# EAGLE design AS6212_breakout (EAGLE 9.6.2)
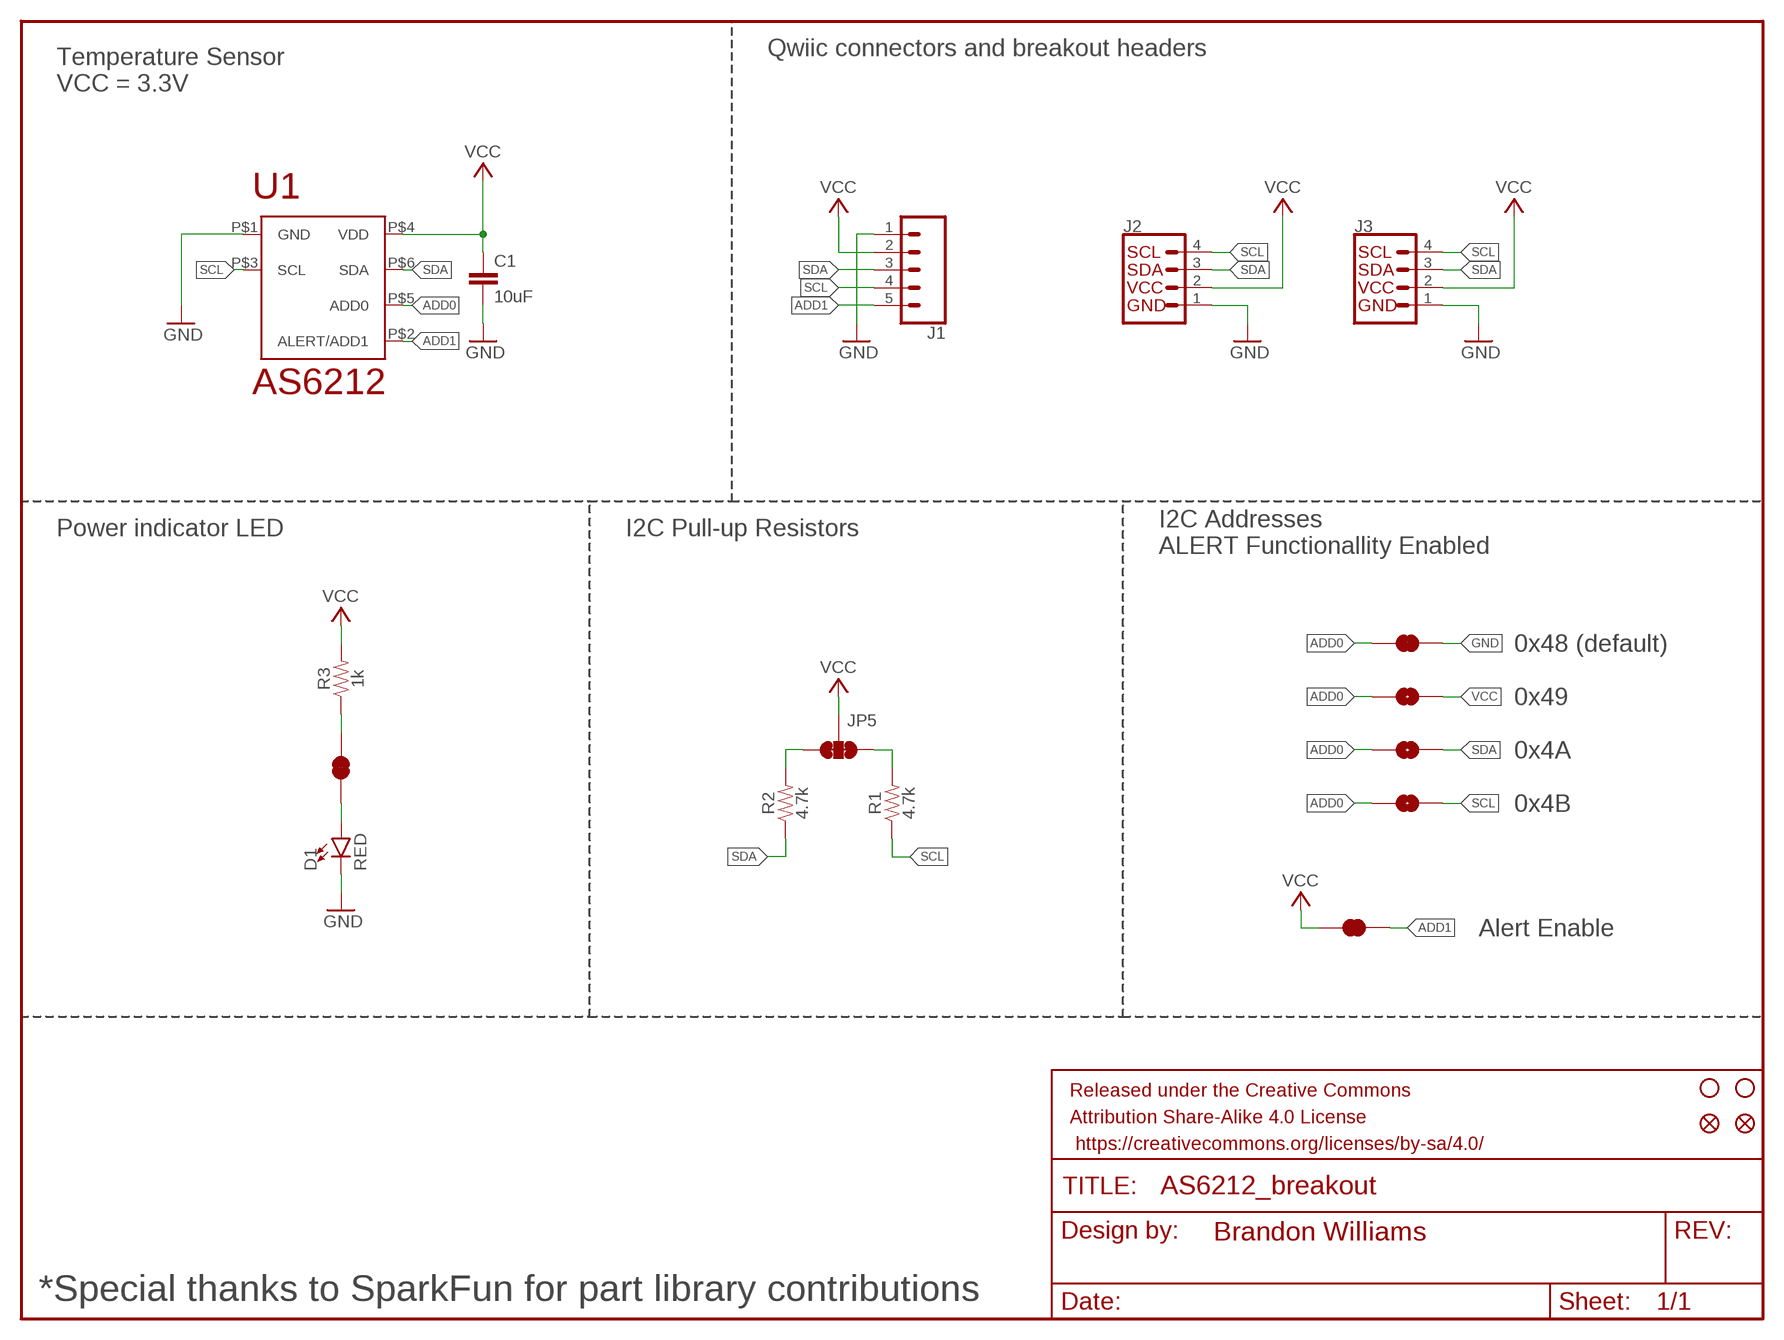
[diagram p0: schematic, sheet 1]

## Parts
C1  10uF  10UF-0805-25V-10%  [0805]
D1  RED  LED-RED0603  [LED-0603]
FD1  FIDUCIAL0.2MM  [FIDUCIAL-0.2MM]
FD2  FIDUCIAL0.2MM  [FIDUCIAL-0.2MM]
FRAME1  FRAME-LETTERNO_PACKAGE  [DUMMY]
H1  STAND-OFF  [STAND-OFF]
H2  STAND-OFF  [STAND-OFF]
J1  CONN_05  [1X05]
J2  QWIIC_RIGHT_ANGLE  QWIIC_CONNECTORJS-1MM  [JST04_1MM_RA]
J3  QWIIC_RIGHT_ANGLE  QWIIC_CONNECTORJS-1MM  [JST04_1MM_RA]
JP1  JUMPER-SMT_2_NO_SILK  [SMT-JUMPER_2_NO_SILK]
JP2  JUMPER-SMT_2_NO_SILK  [SMT-JUMPER_2_NO_SILK]
JP3  JUMPER-SMT_2_NO_SILK  [SMT-JUMPER_2_NO_SILK]
JP4  JUMPER-SMT_2_NC_TRACE_SILK  [SMT-JUMPER_2_NC_TRACE_SILK]
JP5  JUMPER-SMT_3_2-NC_TRACE_SILK  [SMT-JUMPER_3_2-NC_TRACE_SILK]
JP6  JUMPER-SMT_2_NC_TRACE_SILK  [SMT-JUMPER_2_NC_TRACE_SILK]
JP7  JUMPER-SMT_2_NC_TRACE_SILK  [SMT-JUMPER_2_NC_TRACE_SILK]
R1  4.7k  4.7KOHM-0603-1/10W-1%  [0603]
R2  4.7k  4.7KOHM-0603-1/10W-1%  [0603]
R3  1k  1KOHM-0603-1/10W-1%  [0603]
U1  AS6212  [AS6212]

## Nets
ADD0: JP1.1 JP2.1 JP3.1 JP4.1 U1.P$5(ADD0)
ADD1: J1.5 JP6.2 U1.P$2(ALERT/ADD1)
GND: C1.2 D1.C J1.1 J2.1 J3.1 JP4.2 U1.P$1(GND)
N$1: JP5.3 R2.2
N$2: JP5.1 R1.2
N$3: JP7.2 R3.1
N$4: D1.A JP7.1
SCL: J1.4 J2.4 J3.4 JP2.2 R1.1 U1.P$3(SCL)
SDA: J1.3 J2.3 J3.3 JP1.2 R2.1 U1.P$6(SDA)
VCC: C1.1 J1.2 J2.2 J3.2 JP3.2 JP5.2 JP6.1 R3.2 U1.P$4(VDD)

## Notes on the sheet
- Qwiic connectors and breakout headers
- Temperature Sensor
  VCC = 3.3V
- Power indicator LED | I2C Pull-up Resistors
- I2C Addresses
  ALERT Functionallity Enabled
- 0x48 (default)
- 0x49
- 0x4A
- 0x4B
- Alert Enable
- *Special thanks to SparkFun for part library contributions

## Library data of the parts
C1 = SparkFun-Capacitors:10UF: 10.0µF ceramic capacitors A capacitor is a passive two-terminal electrical component used to store electrical energy temporarily in an electric field.; PROD_ID: CAP-14259
D1 = SparkFun-LED:LED-RED: Red SMD LED Used in manufacturing of most products at SparkFun Packages: 0603 - SMD 0603 package [Product Link] <http://docs.avagotech.com/docs/AV02-0551EN> 0603 SMART - SMD 0603 SMART package ( more efficient and expensive)[Product Link] <http://www.osram-os.com/Graphics/XPic2/00077099_0.pdf> 1206 - SMD1206 package [Product Link] <https://www.sparkfun.com/datasheets/DevTools/LilyPad/Q150OVS4.pdff> SparkFun Products: Pro Mini 328 -5V <https://www.sparkfun.com/products/821> RedBoard <https://www.sparkfun.com/products/12757> IOIO-OTG <https://www.sparkfun.com/products/13613>; PROD_ID: DIO-00819
FD1 FD2 = SparkFun-Aesthetics:FIDUCIAL: Fiducial Alignment Points Point-of-reference for pick-and-place machines and other optical instruments.
FRAME1 = SparkFun-Aesthetics:FRAME-LETTER: Schematic Frame - Letter Standard 8.5x11 US Letter frame; DESIGNER: Brandon Williams; VERSION: v01
H1 H2 = SparkFun-Hardware:STAND-OFF: Stand Off Drill holes for mechanically mounting via screws, standoffs, etc. Note: Use the keepout ring to avoid running the screw head into surrounding components. Variant Overviews STAND-OFF - Mechanical footprint for a #4 phillips button head screw. STAND-OFF-TIGHT - Mechanical footprint for a #4 phillips button head screw, Example SparkFun Products Screw - Phillips Head (1/4", 4-40, 10 pack) <https://www.sparkfun.com/products/10453> (PRT-10453) Screw - Phillips Head (1/2", 4-40, 10 pack) <https://www.sparkfun.com/products/10452> (PRT-10452) Screw - Phillips Head (3/4", 4-40, 10 pack) <https://www.sparkfun.com/products/10451> (PRT-10451) Screw - Phillips Head (1", 4-40, 10 pack) <https://www.sparkfun.com/products/10450> (PRT-10450)
J1 = SparkFun-Connectors:CONN_05: Multi connection point. Often used as Generic Header-pin footprint for 0.1 inch spaced/style header connections On any of the 0.1 inch spaced packages, you can populate with these: Break Away Headers - Straight <https://www.sparkfun.com/products/116> (PRT-00116) Break Away Male Headers - Right Angle <https://www.sparkfun.com/products/553> (PRT-00553) Female Headers <https://www.sparkfun.com/products/115> (PRT-00115) Break Away Headers - Machine Pin <https://www.sparkfun.com/products/117> (PRT-00117) Break Away Female Headers - Swiss Machine Pin <https://www.sparkfun.com/products/743> (PRT-00743) For SCREWTERMINALS and SPRING TERMINALS visit here: Screw Terimnals on SparkFun.com <https://www.sparkfun.com/search/results?term=Screw+Terminals> (5mm/3.5mm/2.54mm spacing) This device is also useful as a general connection point to wire up your design to another part of your project. Our various solder wires solder well into these plated through hole pads. Hook-Up Wire - Assortment (Stranded, 22 AWG) <https://www.sparkfun.com/products/11375> (PRT-11375) Hook-Up Wire - Assortment (Solid Core, 22 AWG) <https://www.sparkfun.com/products/11367> (PRT-11367) View the entire wire category on our website here <https://www.sparkfun.com/categories/141> Special notes: Molex polarized connector foot print use with SKU : PRT-08231 with associated crimp pins and housings. 1MM SMD Version SKU: PRT-10208
J2 J3 = SparkFun-Connectors:QWIIC_CONNECTOR: SparkFun I2C Standard Qwiic Connector An SMD 1mm pitch JST connector makes it easy and quick (get it? Qwiic?) to connect I2C devices to each other. The Qwiic system <http://www.sparkfun.com/qwiic> enables fast and solderless connection between popular platforms and various sensors and actuators. We carry 200mm <https://www.sparkfun.com/products/14204>, 100mm <https://www.sparkfun.com/products/14205>, 50mm <https://www.sparkfun.com/products/14206>, and breadboard friendly <https://www.sparkfun.com/products/14207> Qwiic cables. We also offer 10 pcs strips <https://www.sparkfun.com/products/14323> the SMD connectors.; PROD_ID: CONN-13694
JP1-JP3 = SparkFun-Jumpers:JUMPER-SMT_2_NO: Normally open jumper This jumper has two pads in close proximity to each other. Apply solder to close the connection. Round pads are easier to solder for beginners, but are a lot larger. SparkFun Product that uses the round pads: SparkFun EL Sequencer <https://www.sparkfun.com/products/12781>
JP4 JP6 JP7 = SparkFun-Jumpers:JUMPER-SMT_2_NC_TRACE: Normally closed trace jumper This jumper has a trace between two pads so it's normally closed (NC). Use a razor knife to open the connection. For best results follow the IPC guidelines for cutting traces: Cutout at least 0.063 mm (0.005 in). Remove all loose material to clean up the cut area. Seal the cut with an approved epoxy. Reapply solder to reclose the connection.
JP5 = SparkFun-Jumpers:JUMPER-SMT_3_2-NC_TRACE: Normally closed trace jumper (2 of 2 connections) This jumper has a trace between all three pads so they are normally closed (NC). Use a razor knife to open the connection(s). For best results follow the IPC guidelines for cutting traces: Cutout at least 0.063 mm (0.005 in). Remove all loose material to clean up the cut area. Seal the cut with an approved epoxy. Reapply solder to reclose the connection(s).
R1 R2 = SparkFun-Resistors:4.7KOHM: 4.7kΩ resistor A resistor is a passive two-terminal electrical component that implements electrical resistance as a circuit element. Resistors act to reduce current flow, and, at the same time, act to lower voltage levels within circuits. - Wikipedia; PROD_ID: RES-07857
R3 = SparkFun-Resistors:1KOHM: 1kΩ resistor A resistor is a passive two-terminal electrical component that implements electrical resistance as a circuit element. Resistors act to reduce current flow, and, at the same time, act to lower voltage levels within circuits. - Wikipedia; PROD_ID: RES-07856
U1 = AS621x:AS621: The AS621xICfamilyis a high accuracy temperature sensor system that communicates via a 2-wire digital bus with other devices. It consists of a Si bandgap temperature sensor, an ADC and a digital signal processor.

## Board
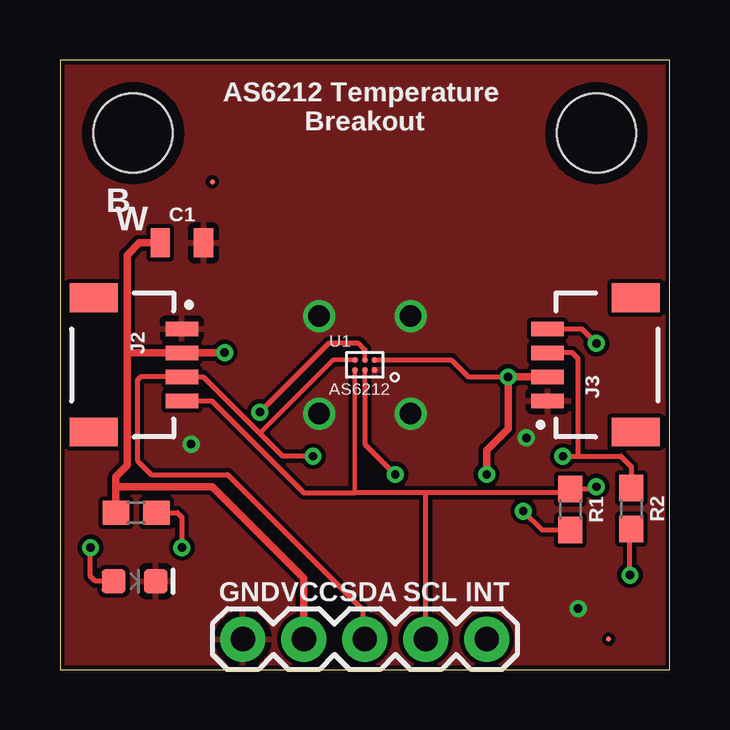
[diagram p1: board, top side]
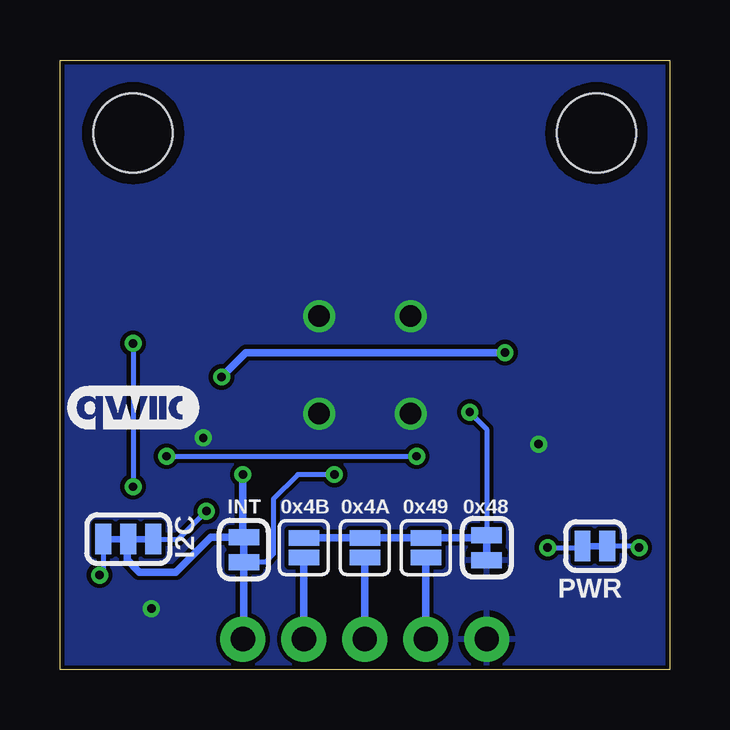
[diagram p2: board, bottom side, seen from below]

Size 25.4 x 25.4 mm. Coordinates in mm from the lower left corner, seen from the top.
Outline: 0,0 25.4,0 25.4,25.4 0,25.4 0,0
Copper layers (1*16): Top 0.035mm / dielectric 1.5mm / Bottom 0.035mm
Design rules "SparkFun-2-Layer-General-JLCPCB": minimum track width 7mil, minimum drill 0.3mm, track to track 7mil, track to pad 7mil, pad to pad 7mil, via to via 7mil, smd to smd 7mil, copper to edge 7mil, drill to drill 7mil, minimum pad ring 7mil, minimum via ring 7mil, stop-mask expansion 3mil, vias tented up to drill 25mil, thermal gap 10mil

### Footprints (pad centres in the part's own frame; a part is rotated, then mirrored left to right if it is on the bottom)
0805 = smd 0.8 x 1.2: 1 -0.9,0; 2 0.9,0
LED-0603 = smd 1 x 1: A -0.877,0; C 0.877,0
FIDUCIAL-0.2MM = smd 0.2 x 0.2: 1 0,0
STAND-OFF = hole 3.302: 0,0
1X05 = drill 1.016 pad 1.88: 1 0,0; 2 2.54,0; 3 5.08,0; 4 7.62,0; 5 10.16,0
JST04_1MM_RA = smd 0.6 x 1.35: 1 -1.5,0; 2 -0.5,0; 3 0.5,0; 4 1.5,0 | smd 1.2 x 2: NC1 2.8,-3.675; NC2 -2.8,-3.675
SMT-JUMPER_2_NO_SILK = smd 0.635 x 1.27: 1 -0.406,0; 2 0.406,0
SMT-JUMPER_2_NC_TRACE_SILK = smd 0.66 x 1.27: 1 -0.521,0; 2 0.521,0
SMT-JUMPER_3_2-NC_TRACE_SILK = smd 0.66 x 1.27: 1 -1.041,0; 2 0,0; 3 1.041,0
0603 = smd 1.1 x 1: 1 -0.85,0; 2 0.85,0
AS6212 = smd 0.25 x 0.25: P$1 0.41,-0.21; P$2 0,-0.21; P$3 -0.41,-0.21; P$4 0.41,0.21; P$5 0,0.21; P$6 -0.41,0.21

### Placement (x,y rotation side)
C1  5.08,17.78 0 top
D1  3.11,3.68 0 top
FD1  6.35,20.32 0 top
FD2  22.86,1.27 0 top
FRAME1  0,0 0 top
H1  3.05,22.35 0 top
H2  22.35,22.35 0 top
J1  7.62,1.27 0 top
J2  5.08,12.7 270 top
J3  20.32,12.7 90 top
JP1  12.7,5.08 270 bottom
JP2  15.24,5.08 270 bottom
JP3  10.16,5.08 270 bottom
JP4  7.62,5.08 270 bottom
JP5  22.56,5.44 180 bottom
JP6  17.74,5 270 bottom
JP7  3.11,5.14 180 bottom
R1  21.26,6.67 270 top
R2  23.8,6.71 270 top
R3  3.17,6.54 180 top
U1  12.7,12.7 0 top
U$1  [QWIIC_5.5MM]  22.35,10.92 0 bottom

### Tracks (layer width: path | path; a pad name or v marks a point on that pad's centre or on a via)
ADD0  (via drill 0.35)
  Top 0.178: U1.P$5 12.7,13.34
  Top 0.203: 12.7,13.34 12.45,13.59 11.19,13.59 v8.33,10.73
  Bottom 0.203: JP4.1 7.62,10.02 v8.33,10.73
  Bottom 0.305: JP4.1 7.73,5.49 JP3.1 JP1.1 JP2.1
ADD1  (via drill 0.35)
  Top 0.178: U1.P$2 12.7,11.94
  Top 0.203: 12.7,11.94 12.7,9.4 v13.97,8.13
  Bottom 0.203: v13.97,8.13 15.49,8.13 16.51,7.11 16.51,4.83 16.86,4.48 JP6.2
  Bottom 0.305: J1.5 17.74,1.31 JP6.2
GND  (via drill 0.35, 0.89)
  other vias: 10.79,10.67 10.79,14.73 14.61,14.73 14.61,10.67 5.46,9.4 21.59,2.54 19.43,9.65
  pour Bottom (isolate 0.178): 0,25.4 0,0 25.4,0 25.4,25.4
  pour Top (isolate 0.178): 0,25.4 0,0 25.4,0 25.4,25.4
N$1  (via drill 0.35)
  Top 0.203: v23.75,3.94 23.75,5.8 R2.2
  Bottom 0.203: JP5.3 23.6,4.09 v23.75,3.94
N$2  (via drill 0.35)
  Top 0.203: v19.3,6.6 20.09,5.82 R1.2
  Bottom 0.203: JP5.1 20.47,5.44 v19.3,6.6
N$3  (via drill 0.35)
  Top 0.203: R3.1 4.89,6.54 5.08,6.35 v5.08,5.08
  Bottom 0.203: v5.08,5.08 3.7,5.08 JP7.2
N$4  (via drill 0.35)
  Top 0.203: D1.A 1.47,3.68 1.27,3.88 v1.27,5.08
  Bottom 0.203: v1.27,5.08 1.33,5.14 JP7.1
SCL  (via drill 0.35)
  Top 0.178: U1.P$3 12.29,7.37
  Top 0.203: 15.24,7.37 21.11,7.37 R1.1 22.25,7.52 v22.35,7.62 | J2.4 6.33,11.2 10.16,7.37 12.29,7.37 15.24,7.37 | J3.4 21.74,14.2 v22.35,13.59 | J1.4 15.24,7.37
  Bottom 0.203: v22.35,13.59 v22.35,7.62
  Bottom 0.305: J1.4 JP2.2
SDA  (via drill 0.35)
  Top 0.178: U1.P$6 11.39,12.91 8.32,9.84
  Top 0.203: R2.1 23.8,8.45 23.37,8.89 21.59,8.89 | v20.95,8.89 21.59,8.89 | 21.59,8.89 21.59,12.95 21.34,13.21 J3.3 | v10.54,8.89 9.27,8.89 8.32,9.84 5.96,12.2 J2.3 3.36,12.2 3.23,12.06 3.23,8.71 3.81,8.13 6.99,8.13 12.62,2.49 12.62,1.35 J1.3
  Bottom 0.203: v20.95,8.89 v10.54,8.89
  Bottom 0.305: J1.3 JP1.2
VCC  (via drill 0.35)
  Top 0.203: U1.P$4 16.3,12.91 17.02,12.19 v18.67,12.19
  Top 0.305: 2.79,13.2 J2.2 v6.85,13.2 v6.86,13.21 | R3.2 2.33,7.62 | 2.33,7.62 2.33,8.04 2.79,8.51 2.79,13.2 | J1.2 10.16,3.81 6.35,7.62 2.33,7.62 | 2.79,13.2 2.79,17.27 3.3,17.78 C1.1 | J3.2 v18.67,12.19 18.67,10.03 17.78,9.14 v17.78,8.13
  Top 0.508: J3.2
  Bottom 0.203: 22.61,5.38 JP5.2
  Bottom 0.305: J1.2 10.16,4.64 | 22.61,5.38 22.61,4.57 22.1,4.06 20.57,4.06 19.12,5.52 JP6.1 17.78,5.56 v17.78,8.13 | v6.86,13.21 17.65,13.21 v18.67,12.19
  Bottom 0.508: 10.16,4.64 JP3.2

### Text on the board
tPlace: AS6212 Temperature / Breakout | B | W | GND | VCC | SDA | SCL | INT
bPlace: 0x48 | 0x49 | 0x4A | 0x4B | INT | I2C | PWR